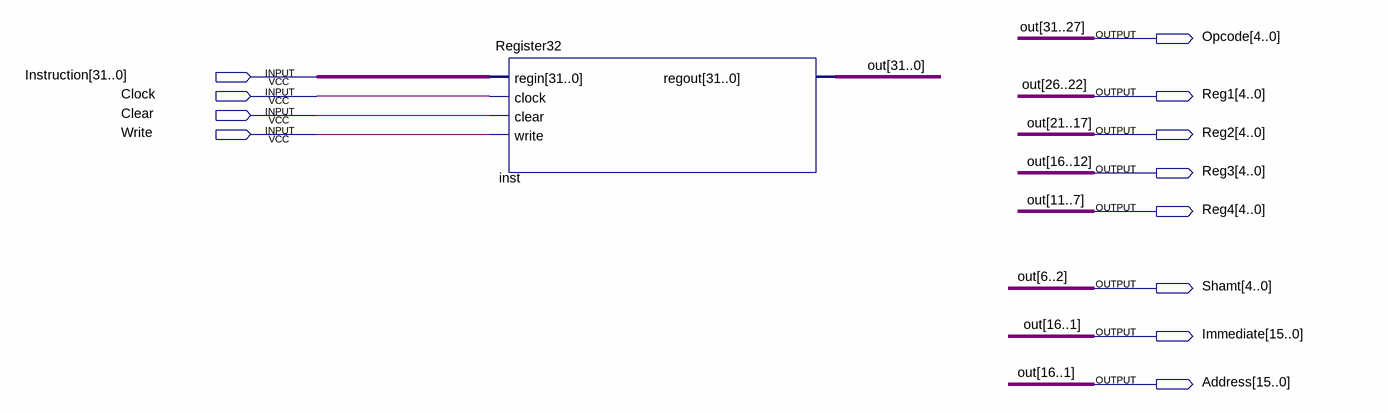
[diagram p0: schematic sheet]
// Quartus schematic IFtoIDRegs.bdf as structural Verilog: 1 symbols, 12 pins
module IFtoIDRegs (
  input  [31:0] Instruction,
  input  Clock,
  input  Clear,
  input  Write,
  output [4:0] Opcode,
  output [4:0] Reg1,
  output [4:0] Reg2,
  output [4:0] Reg3,
  output [4:0] Reg4,
  output [4:0] Shamt,
  output [15:0] Immediate,
  output [15:0] Address
);

  wire [0:0] out;

  Register32 inst (
    .regin(Instruction), .clock(Clock), .clear(Clear), .write(Write),
    .regout({Opcode, Reg1, Reg2, Address, out[0]}));

  assign Immediate = Address;
  assign Reg3 = Address[15:11];
  assign Reg4 = Address[10:6];
  assign Shamt = Address[5:1];

  // Other names for the same wires on the sheet: out[31:1] = {Opcode, Reg1, Reg2, Address}
endmodule
